# EAGLE schematic Main (EAGLE 9.6.2)
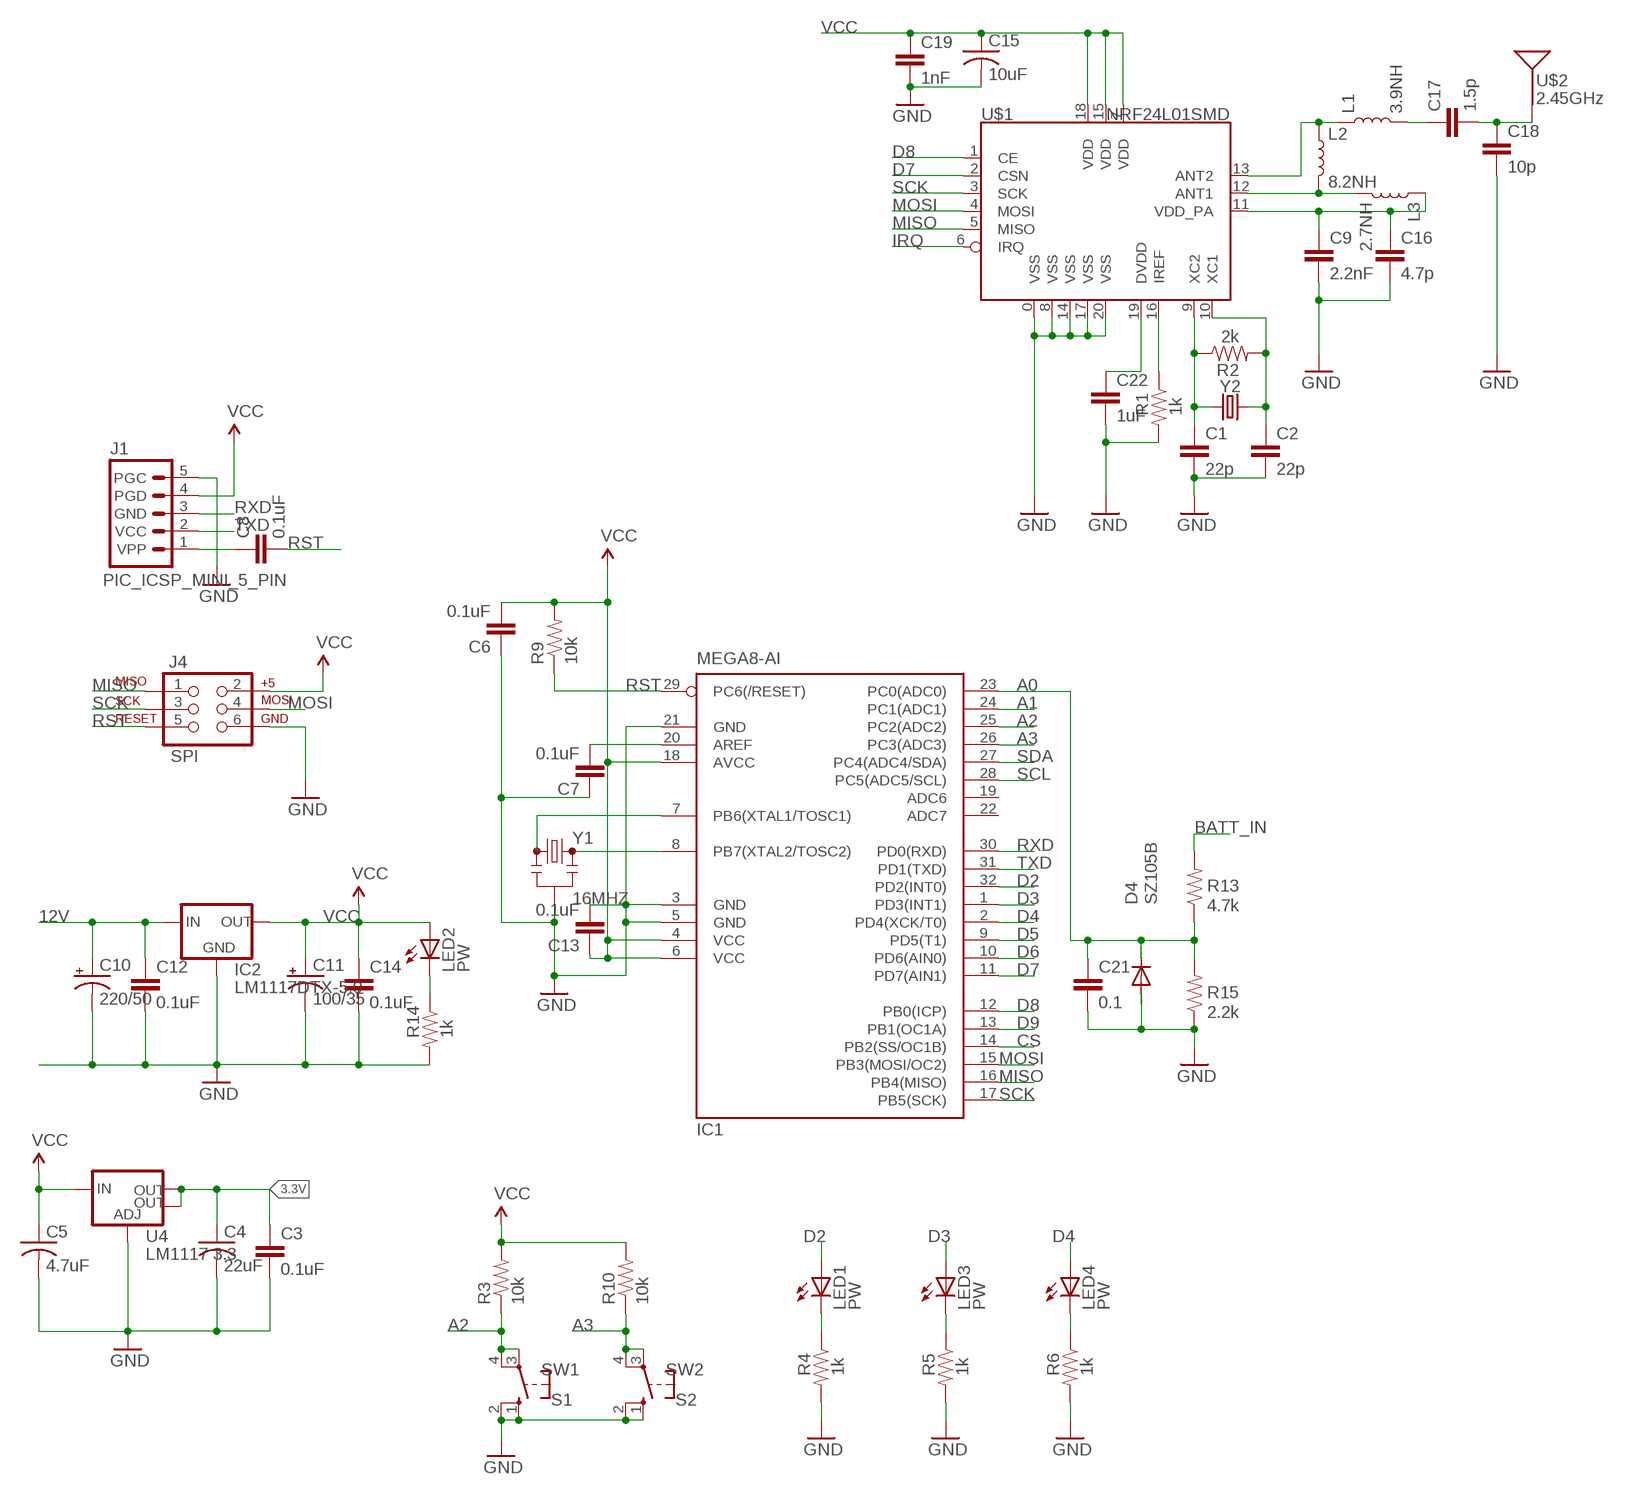
[diagram p0: schematic, sheet 1]

## Parts
C1  22p  CAP0805  [0805]
C2  22p  CAP0805  [0805]
C3  0.1uF  CAP0805  [0805]
C4  22uF  C-USC1206  [C1206]
C5  4.7uF  C-USC1206  [C1206]
C6  0.1uF  CAP0805  [0805]
C7  0.1uF  CAP0805  [0805]
C8  0.1uF  CAP0805  [0805]
C9  2.2nF  CAP0805  [0805]
C10  220/50  CPOL-US153CLV-1010  [153CLV-1010]
C11  100/35  CPOL-US153CLV-0605  [153CLV-0605]
C12  0.1uF  CAP0805  [0805]
C13  0.1uF  CAP0805  [0805]
C14  0.1uF  CAP0805  [0805]
C15  10uF  C-USC1206  [C1206]
C16  4.7p  CAP0805  [0805]
C17  1.5p  CAP0805  [0805]
C18  10p  CAP0805  [0805]
C19  1nF  CAP0805  [0805]
C21  0.1  CAP0805  [0805]
C22  1uF  CAP0805  [0805]
D4  SZ105B  DIODE-DO-214AC  [DO-214AC]
IC1  MEGA8-AI  [TQFP32-08]
IC2  LM1117DTX-5.0  LM1117DTX-3.3  [TO252]
J1  PIC_ICSP_MINI_5_PIN  [PIC_ICSP_MINI_5_PIN]
J4  SPI  AVR_SPI_PRG_6PTH  [2X3]
L1  3.9NH  INDUCTOR-0402-3.9NH  [0402]
L2  8.2NH  INDUCTOR-0402-3.9NH  [0402]
L3  2.7NH  INDUCTOR-0402-3.9NH  [0402]
LED1  PW  LED3MM  [LED3MM]
LED2  PW  LED3MM  [LED3MM]
LED3  PW  LED3MM  [LED3MM]
LED4  PW  LED3MM  [LED3MM]
R1  1k  RESISTOR0805-RES  [0805]
R2  2k  RESISTOR0805-RES  [0805]
R3  10k  RESISTOR0805-RES  [0805]
R4  1k  RESISTOR0805-RES  [0805]
R5  1k  RESISTOR0805-RES  [0805]
R6  1k  RESISTOR0805-RES  [0805]
R9  10k  RESISTOR0805-RES  [0805]
R10  10k  RESISTOR0805-RES  [0805]
R13  4.7k  RESISTOR0805-RES  [0805]
R14  1k  RESISTOR0805-RES  [0805]
R15  2.2k  RESISTOR0805-RES  [0805]
S1  SW1  10-XX  [B3F-10XX]
S2  SW2  10-XX  [B3F-10XX]
U4  LM1117 3.3  V_REG_LM1117SOT223  [SOT223]
U$1  NRF24L01SMD  [QFN20-4X4MM]
U$2  2.45GHz  ANTENNA2.4GHZ-6.5X2.2MM  [ANT-2.4GHZ-6.5X2.2MM]
Y1  16MHZ  RESONATOR16MHZ  [RESONATOR-SMD]
Y2  CRYSTALSMD-5X3.2-4PAD  [CRYSTAL-SMD-5X3.2-4PAD]

## Nets
3.3V: C3.1 C4.1 U4.2(OUT) U4.4(OUT)
12V: C10.+ C12.1 IC2.2(IN)
A0: C21.1 D4.C IC1.23(PC0(ADC0)) R13.1 R15.2
A1: IC1.24(PC1(ADC1))
A2: IC1.25(PC2(ADC2)) R3.1 S1.3(P) S1.4(P1)
A3: IC1.26(PC3(ADC3)) R10.1 S2.3(P) S2.4(P1)
BATT_IN: R13.2
CS: IC1.14(PB2(SS/OC1B))
D2: IC1.32(PD2(INT0)) LED1.A
D3: IC1.1(PD3(INT1)) LED3.A
D4: IC1.2(PD4(XCK/T0)) LED4.A
D5: IC1.9(PD5(T1))
D6: IC1.10(PD6(AIN0))
D7: IC1.11(PD7(AIN1)) U$1.2(CSN)
D8: IC1.12(PB0(ICP)) U$1.1(CE)
D9: IC1.13(PB1(OC1A))
GND: C1.2 C2.2 C3.2 C4.2 C5.2 C6.1 C7.1 C9.2 C10.- C11.- C12.2 C13.2 C14.2 C15.2 C16.2 C18.2 C19.2 C21.2 C22.2 D4.A IC1.3(GND) IC1.5(GND) IC1.21(GND) IC2.1(GND) J1.5(PGC) J4.6 R1.2 R4.2 R5.2 R6.2 R14.2 R15.1 S1.1(S) S1.2(S1) S2.1(S) S2.2(S1) U4.1(ADJ) U$1.0(VSS) U$1.8(VSS) U$1.14(VSS) U$1.17(VSS) U$1.20(VSS) Y1.2
IRQ: U$1.6(IRQ)
MISO: IC1.16(PB4(MISO)) J4.1 U$1.5(MISO)
MOSI: IC1.15(PB3(MOSI/OC2)) J4.4 U$1.4(MOSI)
N$1: LED1.K(C) R4.1
N$2: LED3.K(C) R5.1
N$3: LED4.K(C) R6.1
N$4: C17.1 L1.2
N$5: IC1.8(PB7(XTAL2/TOSC2)) Y1.3
N$7: IC1.7(PB6(XTAL1/TOSC1)) Y1.1
N$8: C7.2 IC1.20(AREF)
N$9: C8.1 J1.1(VPP)
N$12: LED2.K(C) R14.1
N$14: L1.1 L2.1 U$1.13(ANT2)
N$15: L2.2 L3.2 U$1.12(ANT1)
N$16: C9.1 C16.1 L3.1 U$1.11(VDD_PA)
N$17: C22.1 U$1.19(DVDD)
N$18: R1.1 U$1.16(IREF)
N$19: C17.2 C18.1 U$2.FEED(SIGNAL)
N$20: C1.1 R2.1 U$1.9(XC2) Y2.1
N$21: C2.1 R2.2 U$1.10(XC1) Y2.3
RST: C8.2 IC1.29(PC6(/RESET)) J4.5 R9.1
RXD: IC1.30(PD0(RXD)) J1.3(GND)
SCK: IC1.17(PB5(SCK)) J4.3 U$1.3(SCK)
SCL: IC1.28(PC5(ADC5/SCL))
SDA: IC1.27(PC4(ADC4/SDA))
TXD: IC1.31(PD1(TXD)) J1.2(VCC)
VCC: C5.1 C6.2 C11.+ C13.1 C14.1 C15.1 C19.1 IC1.4(VCC) IC1.6(VCC) IC1.18(AVCC) IC2.TAB(OUT) J1.4(PGD) J4.2 LED2.A R3.2 R9.2 R10.2 U4.3(IN) U$1.7(VDD) U$1.15(VDD) U$1.18(VDD)
Unconnected: IC1.19(ADC6) IC1.22(ADC7)

## Library data of the parts
C1-C3 C6-C9 C12-C14 C16-C19 C21 C22 = SparkFun-Passives:CAP: Capacitor Standard 0603 ceramic capacitor, and 0.1" leaded capacitor.
C4 C5 C15 = adafruit:C-US: CAPACITOR, American symbol
C10 C11 = adafruit:CPOL-US: POLARIZED CAPACITOR, American symbol
D4 = diode:DIODE-: DIODE
IC1 = atmel:MEGA8: MICROCONTROLLER 8 Kbytes FLASH, 1 kbytes SRAM, 512 bytes EEPROM, USART, 6-channel 10 bit ADC, 2-channel 8 bit ADC Pin compatible with Atmega48, ATMega88, ATMega168 Source: avr.lbr; MPN: ATMEGA8-16AU; OC_FARNELL: 9171371; OC_NEWARK: 73M8863
IC2 = lm1117:LM1117DTX-*
J1 = SparkFun-Connectors:PIC_ICSP_MINI_5_PIN: PIC-ICSP-Mini Miniature 5-pin connection for temporary programming of PICs. Use this device in your design to save space. Miniature ISCP Programming connector for PICs This 5 pin header contains all the lines necessary for programming most PIC microcontrollers. Use this device in your design to save space. Here is the connector we sell at SparkFun: 5-Pin Mini ICSP Connector <https://www.sparkfun.com/products/11264> (PRT-11264) It is used on these SparkFun products: USB Bit Whacker - 18F2553 Development Board <https://www.sparkfun.com/products/762> (DEV-00762) SparkFun Serial Enabled LCD Backpack <https://www.sparkfun.com/products/258> (LCD-00258) Also, if you need a nice PIC programmer, please check these out: MPLAB PICkit 3 <https://www.sparkfun.com/products/9973> (PGM-09973); PROD_ID: CONN-08314; SF_ID: PRT-11264
J4 = SparkFun-Connectors:AVR_SPI_PRG_6: AVR ISP 6 Pin This is the reduced ISP connector for AVR programming. Common on Arduino. This footprint will take up less PCB space and can be used with a 10-pin to 6-pin adapter such as SKU: BOB-08508 **Special note about "TEST_POINT" package. The stop mask is on the top side, so if you want your programming test points to be on the bottom of your board, make sure to place this package on the bottom side of the board. This also ensure that the orientation to program from the bottom side will be correct.
L1 = SparkFun-Coils:INDUCTOR: Inductors Resist changes in electrical current. Basically a coil of wire. SparkFun Products: SparkFun Load Cell Amplifier - HX711 <https://www.sparkfun.com/products/13879> IOIO-OTG - V2.2 <https://www.sparkfun.com/products/13613>; PROD_ID: NDUC-13457
L2 L3 = SparkFun-Coils:INDUCTOR: Inductors Resist changes in electrical current. Basically a coil of wire. SparkFun Products: SparkFun Load Cell Amplifier - HX711 <https://www.sparkfun.com/products/13879> IOIO-OTG - V2.2 <https://www.sparkfun.com/products/13613>; PROD_ID: NDUC-13457; VALUE: 3.9NH
LED1-LED4 = adafruit:LED: LED OSRAM: - CHIPLED LG R971, LG N971, LY N971, LG Q971, LY Q971, LO R971, LY R971 LH N974, LH R974 LS Q976, LO Q976, LY Q976 LO Q996 - Hyper CHIPLED LW Q18S LB Q993, LB Q99A, LB R99A - SideLED LS A670, LO A670, LY A670, LG A670, LP A670 LB A673, LV A673, LT A673, LW A673 LH A674 LY A675 LS A676, LA A676, LO A676, LY A676, LW A676 LS A679, LY A679, LG A679 - Hyper Micro SIDELED® LS Y876, LA Y876, LO Y876, LY Y876 LT Y87S - SmartLED LW L88C, LW L88S LB L89C, LB L89S, LG L890 LS L89K, LO L89K, LY L89K LS L896, LA L896, LO L896, LY L896 - TOPLED LS T670, LO T670, LY T670, LG T670, LP T670 LSG T670, LSP T670, LSY T670, LOP T670, LYG T670 LG T671, LOG T671, LSG T671 LB T673, LV T673, LT T673, LW T673 LH T674 LS T676, LA T676, LO T676, LY T676, LB T676, LH T676, LSB T676, LW T676 LB T67C, LV T67C, LT T67C, LS T67K, LO T67K, LY T67K, LW E67C LS E67B, LA E67B, LO E67B, LY E67B, LB E67C, LV E67C, LT E67C LW T67C LS T679, LY T679, LG T679 LS T770, LO T770, LY T770, LG T770, LP T770 LB T773, LV T773, LT T773, LW T773 LH T774 LS E675, LA E675, LY E675, LS T675 LS T776, LA T776, LO T776, LY T776, LB T776 LHGB T686 LT T68C, LB T68C - Hyper Mini TOPLED® LB M676 - Mini TOPLED Santana® LG M470 LS M47K, LO M47K, LY M47K Source: http://www.osram.convergy.de/
R1-R6 R9 R10 R13-R15 = SparkFun-Resistors:RESISTOR: Resistor Basic schematic elements and footprints for 0603, 1206, and PTH resistors.
S1 S2 = switch-omron:10-XX: OMRON SWITCH; MPN: B3F-1000; OC_FARNELL: 176432; OC_NEWARK: 36M3542
U4 = SparkFun-PowerIC:V_REG_LM1117: Voltage Regulator LM1117 Standard adjustable voltage regulator but in SMD form. Spark Fun Electronics SKU : COM-00595; PROD_ID: VREG-08170
U$1 = SparkFun-RF:NRF24L01: Nordic nrf24L01 2.4GHz Low-power Transceiver This is the very popular, low cost, very low power RF transceiver from Nordic Semiconductor. Simple SPI interface. SparkFun Products 2.4GHz Transceiver IC - nRF24L01+ <https://www.sparkfun.com/products/690> (COM-00690) SparkFun Transceiver Breakout - nRF24L01+ (RP-SMA) <https://www.sparkfun.com/products/705> (WRL-00705) SparkFun Transceiver Breakout - nRF24L01+ <https://www.sparkfun.com/products/691> (COM-00691); PROD_ID: IC-08950; SF_ID: COM-00690
U$2 = SparkFun-RF:ANTENNA: Single-ended Antennae 2.4GHz and antennae with just one terminal. These are all chip antennae. 2.4GHz (WiFi/BT/ZigBee) Antennae ANT-2.4GHZ-6.5X2.2MM - 6.5 x 2.2 mm chip antenna. (SparkFun Product <https://www.sparkfun.com/products/144>) ANT-2.4GHZ8.0X1.0MM - 8.0 x 1.0 mm chip antenna. (Datasheet <http://www.mouser.com/ds/2/611/antenna_2500at44m0400-242425.pdf>) ANT-2.4GHZ9.5X2.0MM - 9.5 x 2.0 mm chip antenna. (SparkFun Product <https://www.sparkfun.com/products/9025>); PROD_ID: ANT-08187; SF_ID: WRL-00144
Y1 = SparkFun-FreqCtrl:RESONATOR: Resonator Small SMD resonator. Used, eg, on the Arduino Pro/ Pro Mini boards. 8MHz- XTAL-08895 16MHz- XTAL-08900; PROD_ID: XTAL-08900
Y2 = SparkFun-Clocks:CRYSTAL: Crystals (Generic) These are passive quartz crystals, which can be used as a clock source for a microcontroller. Crystal's are two-terminal devices. They require external "load" capacitors to generate an oscillating signal.

## Net classes
1 power: width 0.203 mm